# Altium schematic sheet Motor-42-ClosedLoop.SchDoc
size B; SheetNumber: 1; SheetTotal: 1
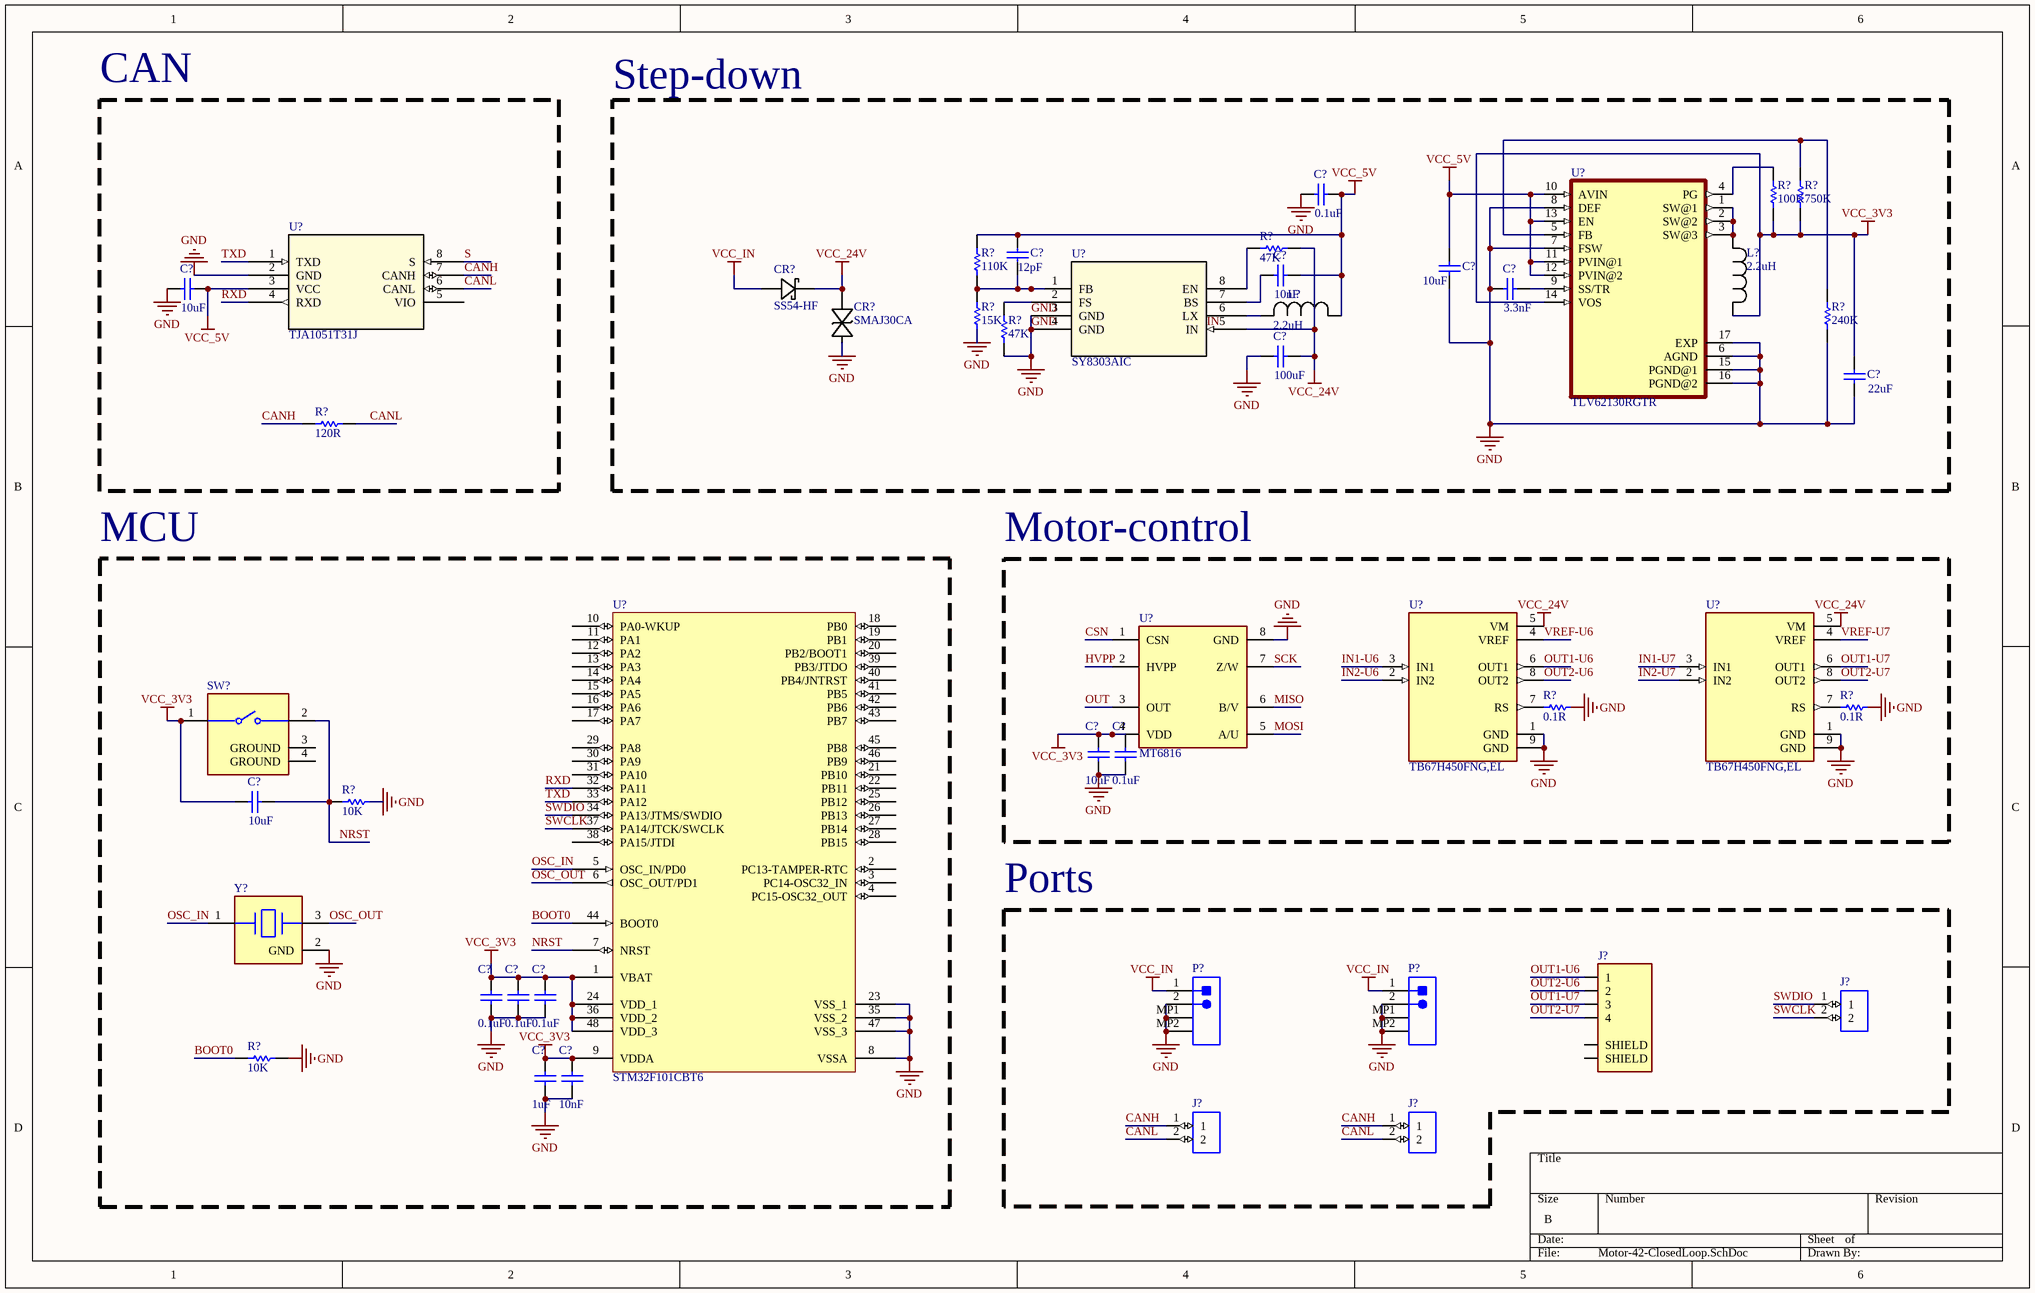
[diagram p0: Motor-42-ClosedLoop.SchDoc]

## Parts
(Parts that share a designator on the sheet are numbered #1, #2 ... from top to bottom, then left to right.)
C?#1  0.1uF  [CAPC1608X90X35ML10T15]
C?#2  12pF  [CAPC1608X90X35ML10T15]
C?#3  10nF  [CAPC1608X90X35ML10T15]
C?#4  10uF  [CAPC1608X90X35ML10T15]
C?#5  10uF  [CAPC1608X90X35ML10T15]
C?#6  3.3nF  [CAPC1608X90X35ML10T15]
C?#7  100uF  [CAPC1608X90X35ML10T15]
C?#8  22uF  [CAPC1608X90X35ML10T15]
C?#9  10uF  [CAPC1608X90X35ML10T15]
C?#10  0.1uF  [CAPC1608X90X35ML10T15]
C?#11  10uF  [CAPC1608X90X35ML10T15]
C?#12  0.1uF  [CAPC1608X90X35ML10T15]
C?#13  0.1uF  [CAPC1608X90X35ML10T15]
C?#14  0.1uF  [CAPC1608X90X35ML10T15]
C?#15  1uF  [CAPC1608X90X35ML10T15]
C?#16  10nF  [CAPC1608X90X35ML10T15]
CR?#1  SS54-HF  [SDO_DO-214AC_CIP]
CR?#2  SMAJ30CA  [SMASeries_LTF]
J?#1  (no value)  [JST_SM04B-SRSS-TB(LF)(SN)]
J?#2  (no value)  [SM02B-SRSS-TB(LF)(SN)]
J?#3  (no value)  [SM02B-SRSS-TB(LF)(SN)]
J?#4  (no value)  [SM02B-SRSS-TB(LF)(SN)]
L?#1  2.2uH  [IND_EPCOS_B82498F_EPC]
L?#2  2.2uH  [IND_EPCOS_B82498F_EPC]
P?#1  (no value)  [JST- S2B-PH-SM4-TB(LF)(SN)-2_V]
P?#2  (no value)  [JST- S2B-PH-SM4-TB(LF)(SN)-2_V]
R?#1  100K  [RESC1608X55X30ML20T20]
R?#2  750K  [RESC1608X55X30ML20T20]
R?#3  47K  [RESC1608X55X30ML20T20]
R?#4  110K  [RESC1608X55X30ML20T20]
R?#5  15K  [RESC1608X55X30ML20T20]
R?#6  240K  [RESC1608X55X30ML20T20]
R?#7  47K  [RESC1608X55X30ML20T20]
R?#8  120R  [RESC1608X55X30ML20T20]
R?#9  0.1R  [RESC1608X55X30ML20T20]
R?#10  0.1R  [RESC1608X55X30ML20T20]
R?#11  10K  [RESC1608X55X30ML20T20]
R?#12  10K  [RESC1608X55X30ML20T20]
SW?  (no value)  [FP-PTS636_SKG25_SMTR_LFS-MFG]
U?#1  TJA1051T31J  [SO8_SOT96-1_NXP]
U?#2  SY8303AIC  [TSOT_303AIC_SGY]
U?#3  TLV62130RGTR  [QFN50P300X300X100-17N]
U?#4  STM32F101CBT6  [LQFP48_N]
U?#5  MT6816  [SOIC127P600X175-8N-8-V]
U?#6  TB67H450FNG,EL  [SOIC127P599X175-9N]
U?#7  TB67H450FNG,EL  [SOIC127P599X175-9N]
Y?  (no value)  [FP-CSTCE_V-MFG]

## Blocks framed on the sheet
CAN: C?#4 R?#8 U?#1
Step-down: C?#1-C?#3 C?#5-C?#8 CR?#1 CR?#2 L?#1 L?#2 R?#1-R?#7 U?#2 U?#3
MCU: C?#11-C?#16 R?#11 R?#12 SW? U?#4 Y?
Motor-control: C?#9 C?#10 R?#9 R?#10 U?#5-U?#7
Ports: J?#1-J?#4 P?#1 P?#2

## Nets
GND: C?#1.1 C?#4.1 C?#5.1 C?#6.1 C?#7.1 C?#8.1 C?#9.1 C?#10.1 C?#12.1 C?#13.1 C?#14.1 C?#15.1 C?#16.1 CR?#2.2 P?#1.2 P?#1.MP1 P?#1.MP2 P?#2.2 P?#2.MP1 P?#2.MP2 R?#5.1 R?#6.1 R?#7.1 R?#11.2 R?#12.2 U?#1.2(GND) U?#2.3(GND) U?#2.4(GND) U?#3.6(AGND) U?#3.7(FSW) U?#3.8(DEF) U?#3.15(PGND@1) U?#3.16(PGND@2) U?#3.17(EXP) U?#4.8(VSSA) U?#4.23(VSS_1) U?#4.35(VSS_2) U?#4.47(VSS_3) U?#5.8(GND) U?#6.1(GND) U?#6.9(GND) U?#7.1(GND) U?#7.9(GND) Y?.2(GND)
VCC_3V3: C?#8.2 C?#9.2 C?#10.2 C?#11.1 C?#12.2 C?#13.2 C?#14.2 C?#15.2 C?#16.2 L?#1.1 R?#1.1 R?#2.1 SW?.1 U?#3.14(VOS) U?#4.1(VBAT) U?#4.9(VDDA) U?#4.24(VDD_1) U?#4.36(VDD_2) U?#4.48(VDD_3) U?#5.4(VDD)
VCC_5V: C?#1.2 C?#2.2 C?#3.2 C?#4.2 C?#5.2 L?#2.1 R?#4.2 U?#1.3(VCC) U?#3.10(AVIN) U?#3.11(PVIN@1) U?#3.12(PVIN@2) U?#3.13(EN)
VCC_24V: C?#7.2 CR?#1.1(CATHODE) CR?#2.1 R?#3.2 U?#2.5(IN) U?#6.5(VM) U?#7.5(VM)
VCC_IN: CR?#1.2(ANODE) P?#1.1 P?#2.1
BOOT0: R?#12.1 U?#4.44(BOOT0)
CANH: J?#3.1 J?#4.1 R?#8.1 U?#1.7(CANH)
CANL: J?#3.2 J?#4.2 R?#8.2 U?#1.6(CANL)
CSN: U?#5.1(CSN)
HVPP: U?#5.2(HVPP)
IN1-U6: U?#6.3(IN1)
IN1-U7: U?#7.3(IN1)
IN2-U6: U?#6.2(IN2)
IN2-U7: U?#7.2(IN2)
MISO: U?#5.6(B/V)
MOSI: U?#5.5(A/U)
NRST: C?#11.2 R?#11.1 SW?.2 U?#4.7(NRST)
OSC_IN: U?#4.5(OSC_IN/PD0) Y?.1(Input)
OSC_OUT: U?#4.6(OSC_OUT/PD1) Y?.3(Output)
OUT: U?#5.3(OUT)
OUT1-U6: J?#1.1 U?#6.6(OUT1)
OUT1-U7: J?#1.3 U?#7.6(OUT1)
OUT2-U6: J?#1.2 U?#6.8(OUT2)
OUT2-U7: J?#1.4 U?#7.8(OUT2)
RXD: U?#1.4(RXD) U?#4.32(PA11)
S: U?#1.8(S)
SCK: U?#5.7(Z/W)
SWCLK: J?#2.2 U?#4.37(PA14/JTCK/SWCLK)
SWDIO: J?#2.1 U?#4.34(PA13/JTMS/SWDIO)
TXD: U?#1.1(TXD) U?#4.33(PA12)
VREF-U6: U?#6.4(VREF)
VREF-U7: U?#7.4(VREF)
NetC?#2_1: C?#2.1 R?#4.1 R?#5.2 U?#2.1(FB)
NetC?#3_1: C?#3.1 U?#2.7(BS)
NetC?#6_2: C?#6.2 U?#3.9(SS/TR)
NetL?#1_2: L?#1.2 U?#3.1(SW@1) U?#3.2(SW@2) U?#3.3(SW@3)
NetL?#2_2: L?#2.2 U?#2.6(LX)
NetR?#1_2: R?#1.2 U?#3.4(PG)
NetR?#2_2: R?#2.2 R?#6.2 U?#3.5(FB)
NetR?#3_1: R?#3.1 U?#2.8(EN)
NetR?#7_2: R?#7.2 U?#2.2(FS)

Not connected (* = marked no-connect by the designer): J?#1 S1(SHIELD) S2(SHIELD); R?#9 1 2; R?#10 1 2; SW? 3(GROUND) 4(GROUND); U?#1 5(VIO); U?#4 2(PC13-TAMPER-RTC) 3(PC14-OSC32_IN) 4(PC15-OSC32_OUT) 10(PA0-WKUP) 11(PA1) 12(PA2) 13(PA3) 14(PA4) 15(PA5) 16(PA6) 17(PA7) 18(PB0) 19(PB1) 20(PB2/BOOT1) 21(PB10) 22(PB11) 25(PB12) 26(PB13) 27(PB14) 28(PB15) 29(PA8) 30(PA9) 31(PA10) 38(PA15/JTDI) 39(PB3/JTDO) 40(PB4/JNTRST) 41(PB5) 42(PB6) 43(PB7) 45(PB8) 46(PB9); U?#6 7(RS); U?#7 7(RS)

## Notes on the sheet
- Labels drawn without touching a wire or pin: GND, IN

## Library data of the parts
C?#1-C?#16 = CMP-2006-02924-1: Part Number: GRM188R71H472KA01D; Manufacturer: Murata
CR?#1 = SS54-HF: No Description Available; Mfr_Name: Comchip; Type: Diodes - Rectifiers, Single
CR?#2 = SMAJ30CA: No Description Available; Mfr_Name: Littelfuse Inc
J?#1 = SM04B-SRSS-TB(LF)(SN): SH Series 1.0 mm Pitch 2 Position Single Row Side Entry Shrouded Header; Price: None; Value: *; MP: SM04B-SRSS-TB(LF)(SN); Package: None; Availability: Unavailable
J?#2-J?#4 = SM02B-SRSS-TB(LF)(SN): Connector Header Surface Mount, Right Angle 2 position 0.039 _1.00mm_; MP: SM02B-SRSS-TB_LF__SN_; MF: JST Sales; SnapEDA_Link: https://www.snapeda.com/parts/SM02B-SRSS-TB%28LF%29%28SN%29/JST%20Sales%20America%20Inc./view-part/447499/?ref=snap; Price: None; Value: *; Availability: Unavailable; Package: None
L?#1 L?#2 = B82498F3100+000: No Description Available; Mfr_Name: TDK
P?#1 P?#2 = CMP-1755-00001-1: Male Header, Pitch 2 mm, 1 x 2 Position, Height 5.5 mm, -25 to 85 degC, RoHS, Tape and Reel; Current Rating: 3 A; ComponentLink1URL: http://www.jst.com/home2.html; Radiation Hardening: No; RoHSCompliant: True; Mount: Through Hole; Contact Material: Bronze; Package Quantity: 100; Width: 2.34 mm; DatasheetVersion: Dec-12; Height: 8.13 mm; Max Operating Temperature: 105degC; ComponentLink2Description: Datasheet; Lead Pitch: 0.1 inch; Contact Finish: Lead; Packaging: Bulk; Colour: Black; Contact Plating: Tin; Min Operating Temperature: -65degC; ComponentLink1Description: Manufacturer URL; PackageReference: S2B-PH-SM4-TB(LF)(SN)-2; PackageDescription: Male Header, Pitch 2 mm, 1 x 2 Position, Height 5.5 mm; ComponentLink2URL: http://www.jst-mfg.com/product/pdf/eng/ePH.pdf; Pins: 40; Length: 101.19 mm
R?#1-R?#12 = CMP-2000-00054-1: Part Number: ERA3AEB392V; Manufacturer: Panasonic
SW? = CMP-10040-000025-1: TACT 6.0 X 3.5, 2.5 MM H, 250GF,
U?#1 = TJA1051T31J: No Description Available; Mfr_Name: NXP; RefDes: RefDes; Type: Type
U?#2 = SY8303AIC: No Description Available; Mfr_Name: Silergy; RefDes: RefDes; Type: Type
U?#3 = TLV62130RGTR: 3-17V 3A Step-Down Converter in 3x3 QFN Package 16-VQFN -40 to 85; MF: Texas Instruments; Mouser-Purchase-URL: https://snapeda.com/shop?store=Mouser&id=423292; MP: TLV62130RGTR; Value: *; DigiKey-Purchase-URL: https://snapeda.com/shop?store=DigiKey&id=423292; Package: VQFN-16 Texas Instruments; Texas_Instruments-Purchase-URL: https://snapeda.com/shop?store=Texas+Instruments&id=423292; Price: None; Availability: Unavailable; SnapEDA_Link: https://www.snapeda.com/parts/TLV62130RGTR/Texas%20Instruments/view-part/423292/?ref=snap
U?#4 = STM32F101CBT6: STM32 ARM-based 32-bit MCU with 128 Kbytes Flash, 48-pin LQFP, Industrial Temperature; Published: 30-May-2008; DatasheetVersion: rev6, Mar-2008; PackageVersion: Mar-2008; PackageReference: LQFP48; Publisher: Altium Limited; PackageDescription: 48-Pin Low-Profile Quad Flat Pack, 7 x 7 mm Body, 0.5 mm Pitch (LQFP48); ComponentLink1Description: Manufacturer Link; ComponentLink1URL: www.st.com/stm32; ComponentLink2Description: Datasheet; ComponentLink2URL: http://www.st.com/stonline/products/literature/ds/13586.pdf
U?#5 = TLE5012B_E1000: TLE5012B/TLI5012B Angular and Linear Position Sensor Evaluation Board Automotive; MF: Infineon Technologies; MP: TLE5012B E1000; Package: SOIC-8 Infineon Technologies; Price: None; Value: *; SnapEDA_Link: https://www.snapeda.com/parts/TLE5012B%20E1000/Infineon+Technologies/view-part/?ref=snap; Availability: In Stock; Check_prices: https://www.snapeda.com/parts/TLE5012B%20E1000/Infineon+Technologies/view-part/?ref=eda
U?#6 U?#7 = TB67H450FNG,EL: - Motor Driver - - 8-HSOP; MF: Toshiba Semiconductor and Storage; Package: SOIC-8 Toshiba Semiconductor and Storage; Price: None; Check_prices: https://www.snapeda.com/parts/TB67H450FNG,EL/Toshiba+Semiconductor+and+Storage/view-part/?ref=eda; Value: *; SnapEDA_Link: https://www.snapeda.com/parts/TB67H450FNG,EL/Toshiba+Semiconductor+and+Storage/view-part/?ref=snap; MP: TB67H450FNG,EL; Availability: In Stock; Purchase-URL: https://pricing.snapeda.com/search?q=TB67H450FNG,EL&ref=eda
Y? = CMP-06057-000013-1: CERAMIC RES 20.0000MHZ 15PF SMD; Self Resonant Frequency: 20MHz; Frequency Stability: 0.3%; Tolerance: 0.5%; Impedance: 40R; Height: 0.039inch; Package Quantity: 3000; Capacitance: 15pF; Mount: Surface Mount; Length: 0.126inch; Load Capacitance: 15pF; Resistor Type: Ceramic; Width: 0.051inch; Termination: SMD/SMT; Frequency Tolerance: 0.5%; Case/Package: SMD/SMT; Contact Plating: Gold; Lead Free: Lead Free; Number of Pins: 3; Packaging: Tape and Reel; Min Operating Temperature: -20°C; REACH SVHC: No SVHC; Max Operating Temperature: 80°C; Frequency: 20MHz